# EAGLE design Binary-Watch_Rev_A (EAGLE 4.16)
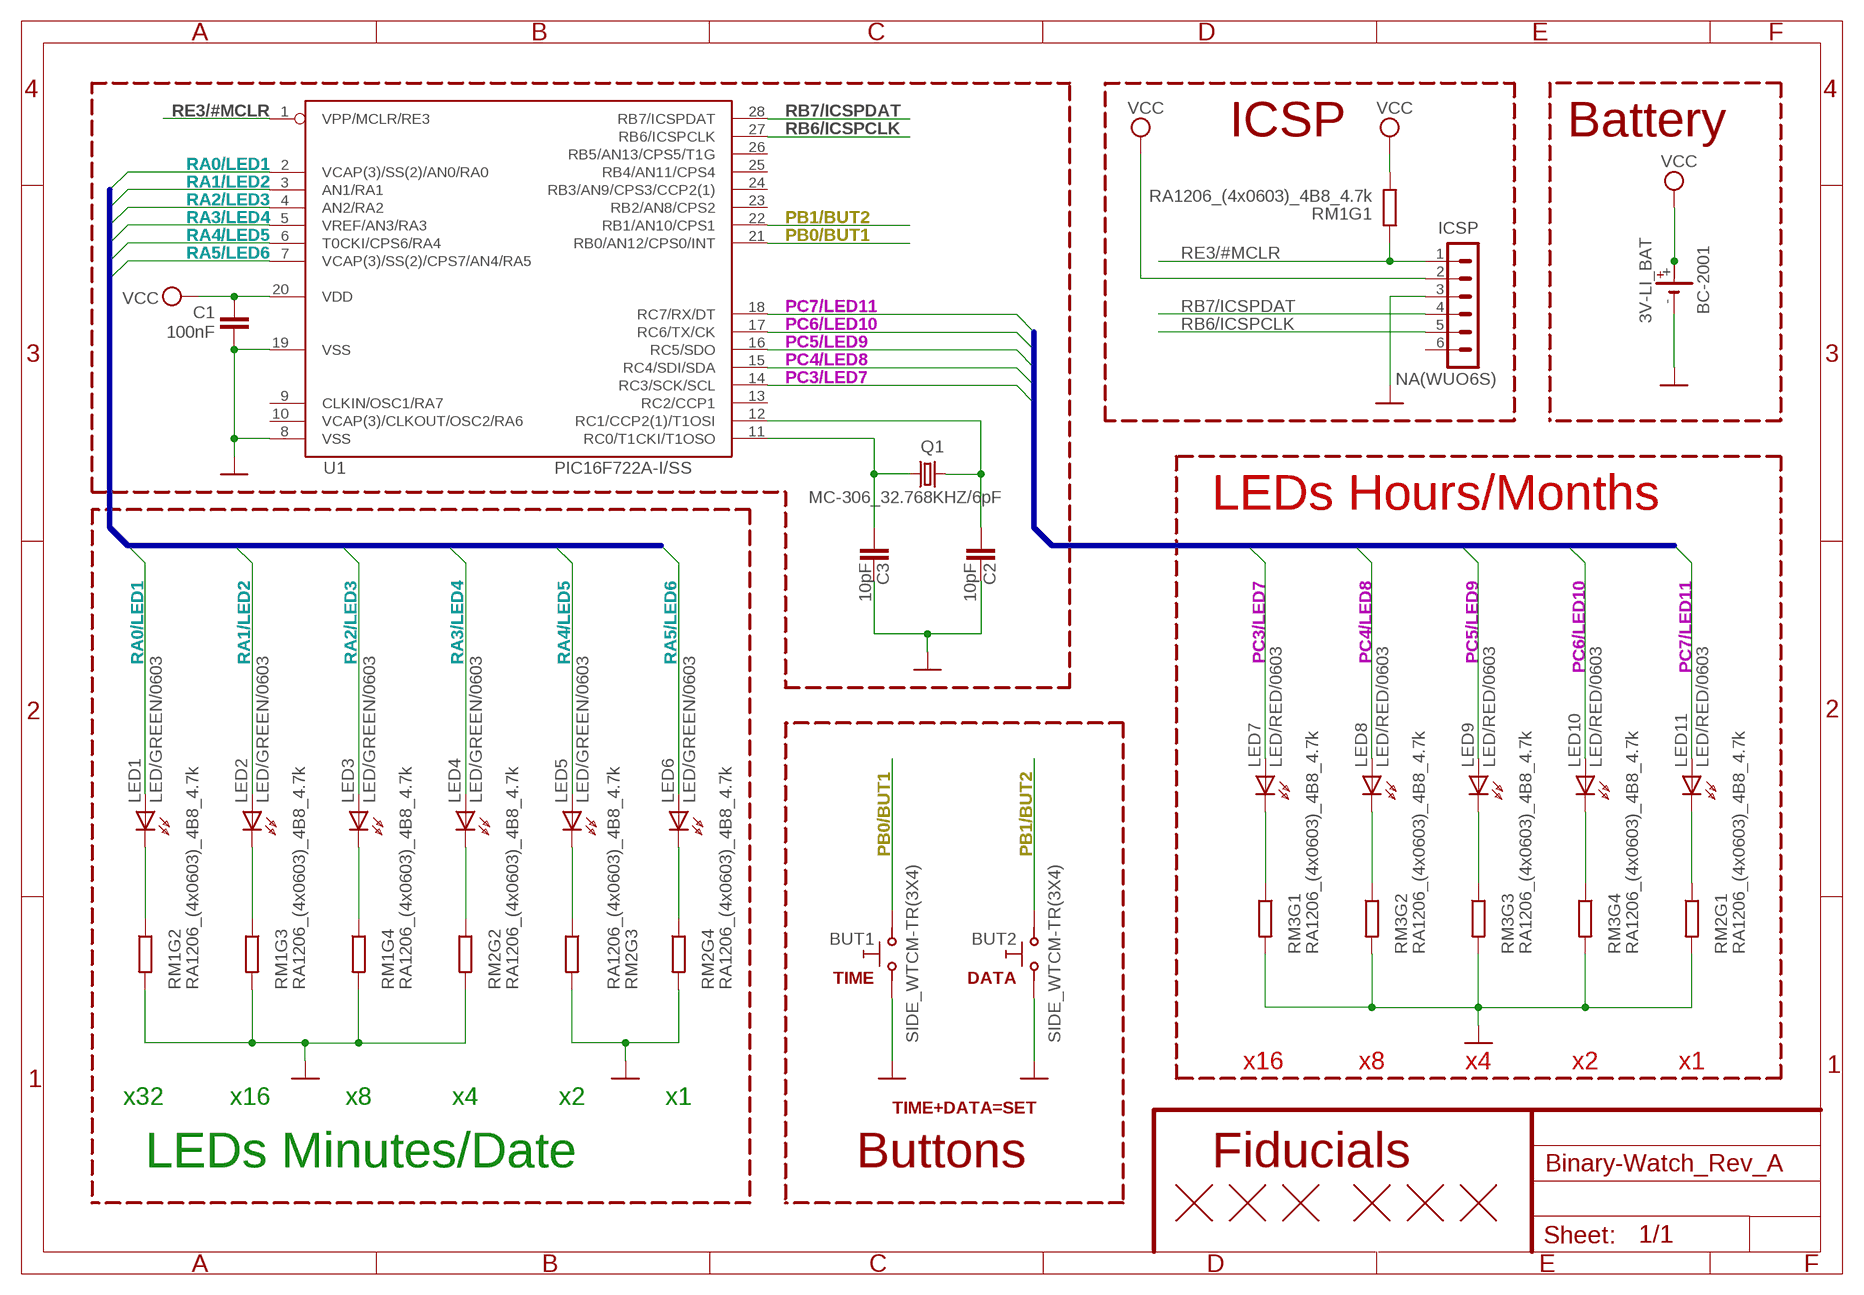
[diagram p0: schematic, sheet 1]

## Parts
3V-LI_BAT  BC-2001  BFLATWISE  [BAT-FLATWISE]
BUT1  SIDE_WTCM-TR(3X4)  SW-TAKTSIDE_WTCM-TR(3X4)  [SW_TAKT3X4]
BUT2  SIDE_WTCM-TR(3X4)  SW-TAKTSIDE_WTCM-TR(3X4)  [SW_TAKT3X4]
C1  100nF  C-EUC0603_DWS  [C0603_DWS]
C2  10pF  C-EUC0603_DWS  [C0603_DWS]
C3  10pF  C-EUC0603_DWS  [C0603_DWS]
FID1  FIDUCIAL  [FIDUCIAL-1X3]
FID2  FIDUCIAL  [FIDUCIAL-1X3]
FID3  FIDUCIAL  [FIDUCIAL-1X3]
FID4  FIDUCIAL  [FIDUCIAL-1X3]
FID5  FIDUCIAL  [FIDUCIAL-1X3]
FID6  FIDUCIAL  [FIDUCIAL-1X3]
ICSP  NA(WUO6S)  CON6WUO6S  [WU06S]
LED1  LED/GREEN/0603  LEDLED_0603_32_B  [LED_0603_32_B]
LED2  LED/GREEN/0603  LEDLED_0603_16_B  [LED_0603_16_B]
LED3  LED/GREEN/0603  LEDLED_0603_8_B  [LED_0603_8_B]
LED4  LED/GREEN/0603  LEDLED_0603_4_B  [LED_0603_4_B]
LED5  LED/GREEN/0603  LEDLED_0603_2_B  [LED_0603_2_B]
LED6  LED/GREEN/0603  LEDLED_0603_1_B  [LED_0603_1_B]
LED7  LED/RED/0603  LEDLED_0603_16_T  [LED_0603_16_T]
LED8  LED/RED/0603  LEDLED_0603_8_T  [LED_0603_8_T]
LED9  LED/RED/0603  LEDLED_0603_4_T  [LED_0603_4_T]
LED10  LED/RED/0603  LEDLED_0603_2_T  [LED_0603_2_T]
LED11  LED/RED/0603  LEDLED_0603_1_T  [LED_0603_1_T]
Q1  MC-306_32.768KHZ/6pF  MC-306_32.768KHZ/SMD_8038  [MC-306]
RM1  RA1206_(4x0603)_4B8_4.7k  R_MATRIX_4E  [R_MATRIX_4]
RM2  RA1206_(4x0603)_4B8_4.7k  R_MATRIX_4E  [R_MATRIX_4]
RM3  RA1206_(4x0603)_4B8_4.7k  R_MATRIX_4E  [R_MATRIX_4]
U1  PIC16F722A-I/SS  [SSOP28]

## Nets
GND: 3V-LI_BAT.- BUT1.2_1 BUT2.2_1 C1.2 C2.1 C3.1 ICSP.3 RM1.2.2 RM1.3.2 RM1.4.2 RM2.1.2 RM2.2.2 RM2.3.2 RM2.4.2 RM3.1.2 RM3.2.2 RM3.3.2 RM3.4.2 U1.8(VSS) U1.19(VSS)
N$1: LED1.C RM1.2.1
N$2: LED2.C RM1.3.1
N$3: LED3.C RM1.4.1
N$4: LED4.C RM2.2.1
N$5: LED5.C RM2.3.1
N$6: LED6.C RM2.4.1
N$8: C2.2 Q1.1 U1.12(RC1/CCP2(1)/T1OSI)
N$9: C3.2 Q1.4 U1.11(RC0/T1CKI/T1OSO)
N$10: LED7.C RM3.1.1
N$11: LED8.C RM3.2.1
N$12: LED9.C RM3.3.1
N$13: LED10.C RM3.4.1
N$15: LED11.C RM2.1.1
PB0/BUT1: BUT1.1_1 U1.21(RB0/AN12/CPS0/INT)
PB1/BUT2: BUT2.1_1 U1.22(RB1/AN10/CPS1)
PC3/LED7: LED7.A U1.14(RC3/SCK/SCL)
PC4/LED8: LED8.A U1.15(RC4/SDI/SDA)
PC5/LED9: LED9.A U1.16(RC5/SDO)
PC6/LED10: LED10.A U1.17(RC6/TX/CK)
PC7/LED11: LED11.A U1.18(RC7/RX/DT)
RA0/LED1: LED1.A U1.2(VCAP(3)/SS(2)/AN0/RA0)
RA1/LED2: LED2.A U1.3(AN1/RA1)
RA2/LED3: LED3.A U1.4(AN2/RA2)
RA3/LED4: LED4.A U1.5(VREF/AN3/RA3)
RA4/LED5: LED5.A U1.6(T0CKI/CPS6/RA4)
RA5/LED6: LED6.A U1.7(VCAP(3)/SS(2)/CPS7/AN4/RA5)
RB6/ICSPCLK: ICSP.5 U1.27(RB6/ICSPCLK)
RB7/ICSPDAT: ICSP.4 U1.28(RB7/ICSPDAT)
RE3/#MCLR: ICSP.1 RM1.1.2 U1.1(VPP/MCLR/RE3)
VCC: 3V-LI_BAT.+ 3V-LI_BAT.+@1(+) C1.1 ICSP.2 RM1.1.1 U1.20(VDD)
Unconnected: ICSP.6 U1.9(CLKIN/OSC1/RA7) U1.10(VCAP(3)/CLKOUT/OSC2/RA6) U1.13(RC2/CCP1) U1.23(RB2/AN8/CPS2) U1.24(RB3/AN9/CPS3/CCP2(1)) U1.25(RB4/AN11/CPS4) U1.26(RB5/AN13/CPS5/T1G)

## Buses
RA0/LED1,RA1/LED2,RA2/LED3,RA3/LED4,RA4/LED5,RA5/LED6
PC3/LED7,PC4/LED8,PC5/LED9,PC6/LED10,PC7/LED11

## Notes on the sheet
- ICSP | Battery
- LEDs Hours/Months
- TIME | DATA
- x16 | x8 | x4 | x2 | x1
- x32 | x16 | x8 | x4 | x2 | x1
- TIME+DATA=SET
- LEDs Minutes/Date | Buttons | Fiducials

## Library data of the parts
3V-LI_BAT = DOUBLE-SIDE:B: LI BATTERY Varta
BUT1 BUT2 = gogo:SW-TAKT
C1-C3 = rcl:C-EU: CAPACITOR, European symbol
FID1-FID6 = SparkFunEagle-6-6-07:FIDUCIAL: Fiducial Alignment Points Various fiducial points for machine vision alignment.
ICSP = Penko:CON6: CONNECTORS - 6 PINS
LED1-LED11 = DOUBLE-SIDE:LED
Q1 = crystal:MC-306
RM1-RM3 = OLIMEX_DISCRET:R_MATRIX_4E
U1 = OLIMEX_IC:PIC16F722A: PIC16F722A Description: 28-Pin Flash Microcontrollers with nanoWatt XLP Technology

## Net classes
1 pwr: width 1.016 mm, drill 0.241 mm

## Board
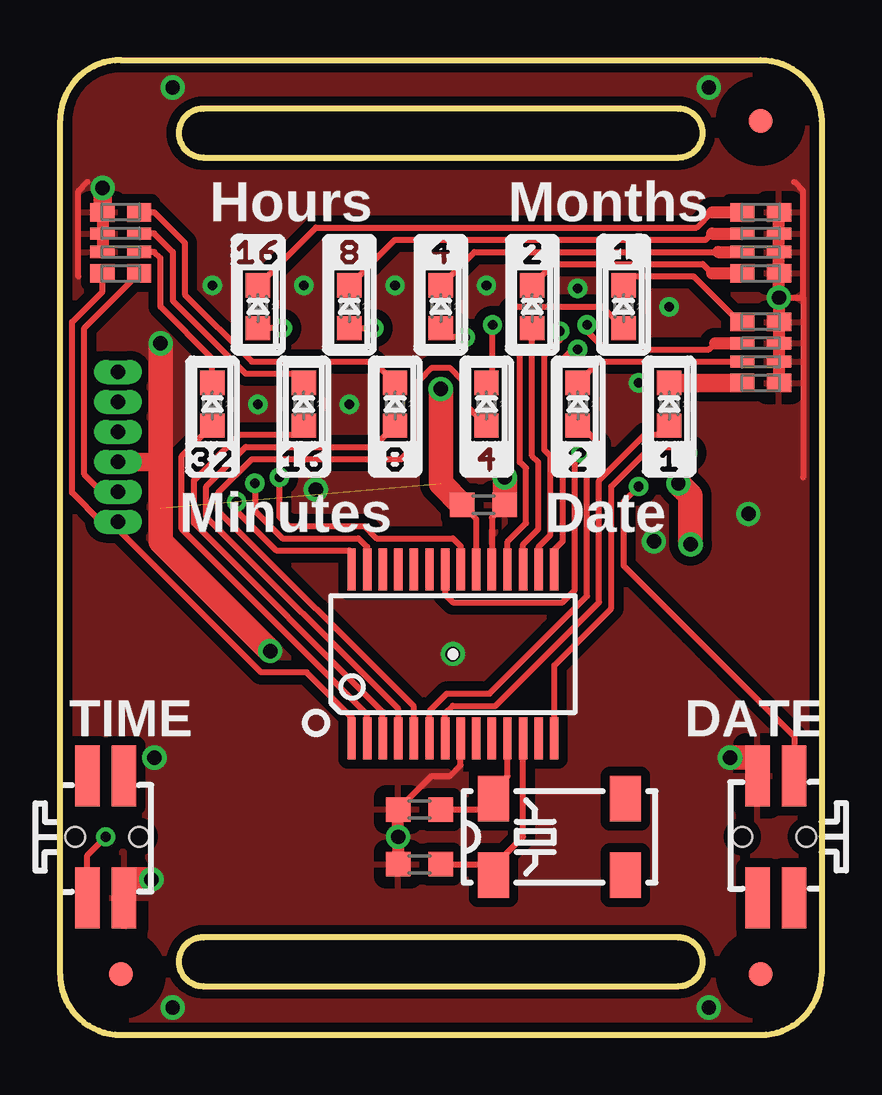
[diagram p1: board, top side]
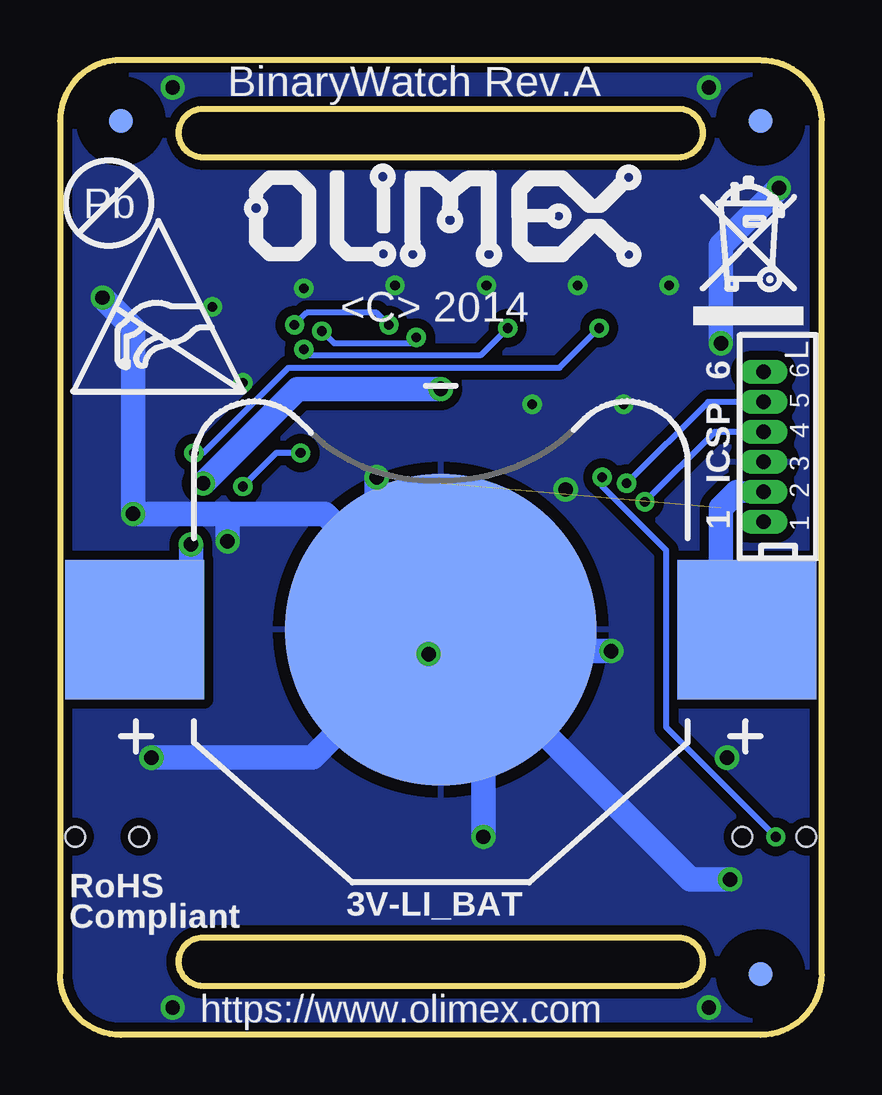
[diagram p2: board, bottom side, seen from below]

Size 31.75 x 40.64 mm. Coordinates in mm from the lower left corner, seen from the top.
Outline: 0,2.54 0,38.1 arc-90 2.54,40.64 29.21,40.64 arc-90 31.75,38.1 31.75,2.54 arc-90 29.21,0 2.54,0 arc-90 0,2.54
Outline: 5.97,36.58 25.78,36.58 arc180 25.78,38.61 5.97,38.61 arc180 5.97,36.58
Outline: 5.97,2.03 25.78,2.03 arc180 25.78,4.06 5.97,4.06 arc180 5.97,2.03
Copper layers (1*16): Top 0.035mm / dielectric 1.5mm / Bottom 0.035mm
Design rules "default": minimum track width 10mil, minimum drill 15mil, track to track 8mil, track to pad 8mil, pad to pad 8mil, via to via 8mil, smd to smd 1mil, copper to edge 10mil, drill to drill 8mil, minimum pad ring 7mil, minimum via ring 8mil, stop-mask expansion 4mil, vias tented up to drill 40mil, thermal gap 20mil

### Footprints (pad centres in the part's own frame; a part is rotated, then mirrored left to right if it is on the bottom)
BAT-FLATWISE = smd 5.8 x 5.8: + 12.764,0; +@1 -12.764,0 | smd 13 x 13: - 0,0
SW_TAKT3X4 = smd 2.54 x 1.016: 1_1 -2.54,0.762; 1_2 2.54,0.762; 2_1 -2.54,-0.762; 2_2 2.54,-0.762 | hole 0.8: 0,-1.397; 0,1.27
C0603_DWS = smd 1.016 x 1.016: 1 -0.889,0; 2 0.889,0
FIDUCIAL-1X3 = smd 1 x 1: 1 0,0
WU06S = drill 0.6 pad 0.991 long: 1 -3.125,0; 2 -1.875,0; 3 -0.625,0; 4 0.625,0; 5 1.875,0; 6 3.125,0
LED_0603_32_B = smd 1.016 x 1.016: A 0.889,0; C -0.889,0
LED_0603_16_B = smd 1.016 x 1.016: A 0.889,0; C -0.889,0
LED_0603_8_B = smd 1.016 x 1.016: A 0.889,0; C -0.889,0
LED_0603_4_B = smd 1.016 x 1.016: A 0.889,0; C -0.889,0
LED_0603_2_B = smd 1.016 x 1.016: A 0.889,0; C -0.889,0
LED_0603_1_B = smd 1.016 x 1.016: A 0.889,0; C -0.889,0
LED_0603_16_T = smd 1.016 x 1.016: A 0.889,0; C -0.889,0
LED_0603_8_T = smd 1.016 x 1.016: A 0.889,0; C -0.889,0
LED_0603_4_T = smd 1.016 x 1.016: A 0.889,0; C -0.889,0
LED_0603_2_T = smd 1.016 x 1.016: A 0.889,0; C -0.889,0
LED_0603_1_T = smd 1.016 x 1.016: A 0.889,0; C -0.889,0
MC-306 = smd 1.3 x 1.9: 1 -2.75,-1.6; 2 2.75,-1.6; 3 2.75,1.6; 4 -2.75,1.6
R_MATRIX_4 = smd 0.762 x 1.016: 1.1 -1.27,-0.762; 1.2 -1.27,0.762; 4.1 1.27,-0.762; 4.2 1.27,0.762 | smd 0.508 x 1.016: 2.1 -0.381,-0.762; 2.2 -0.381,0.762; 3.1 0.381,-0.762; 3.2 0.381,0.762
SSOP28 = smd 0.35 x 1.75: 1 -4.225,-3.525; 2 -3.575,-3.525; 3 -2.925,-3.525; 4 -2.275,-3.525; 5 -1.625,-3.525; 6 -0.975,-3.525; 7 -0.325,-3.525; 8 0.325,-3.525; 9 0.975,-3.525; 10 1.625,-3.525; 11 2.275,-3.525; 12 2.925,-3.525; 13 3.575,-3.525; 14 4.225,-3.525; 15 4.225,3.525; 16 3.575,3.525; 17 2.925,3.525; 18 2.275,3.525; 19 1.625,3.525; 20 0.975,3.525; 21 0.325,3.525; 22 -0.325,3.525; 23 -0.975,3.525; 24 -1.625,3.525; 25 -2.275,3.525; 26 -2.925,3.525; 27 -3.575,3.525; 28 -4.225,3.525

### Placement (x,y rotation side)
3V-LI_BAT  15.88,16.89 180 bottom
BUT1  1.91,8.26 90 top
BUT2  29.84,8.26 270 top
C1  17.65,22.1 0 top
C2  14.99,7.11 0 top
C3  14.99,9.4 0 top
FID1  2.54,2.54 0 top
FID2  29.21,2.54 0 top
FID3  29.21,38.1 0 top
FID4  2.54,2.54 0 bottom
FID5  2.54,38.1 0 bottom
FID6  29.21,38.1 0 bottom
ICSP  2.41,24.51 90 bottom
LED1  6.35,26.29 270 top
LED2  10.16,26.29 270 top
LED3  13.97,26.29 270 top
LED4  17.78,26.29 270 top
LED5  21.59,26.29 270 top
LED6  25.4,26.29 270 top
LED7  8.26,30.35 270 top
LED8  12.06,30.35 270 top
LED9  15.88,30.35 270 top
LED10  19.68,30.35 270 top
LED11  23.5,30.35 270 top
Q1  20.83,8.26 0 top
RM1  2.54,33.02 90 top
RM2  29.21,28.45 270 top
RM3  29.21,33.02 270 top
U1  16.38,15.88 0 top
U$1  [ESD_SYMBOL]  31.2,26.82 0 bottom
U$5  [PB_SMALL]  29.72,34.67 0 bottom
U$6  [RECYCLE_BIN1/8]  5.33,29.59 0 bottom
U$7  [OLIMEX1_V]  6.35,31.88 0 bottom

### Tracks (layer width: path | path; a pad name or v marks a point on that pad's centre or on a via)
GND  (via drill 0.4, 0.6)
  Top 0.254: 0.76,31.62 0.76,35.18 1.14,35.56 | v29.97,30.73 30.99,30.73 | 30.99,30.73 30.99,35.18 30.61,35.56 | 30.99,30.73 30.99,23.24 | U1.19 18.01,21.56 C1.2 | U1.8 16.71,11.25 16.26,10.79 15.49,10.79 C3.1
  Top 0.508: RM1.4.2 RM1.3.2 RM1.2.2 | RM3.1.2 RM3.2.2 RM3.3.2 RM3.4.2 v29.97,30.73 RM2.1.2 RM2.2.2 RM2.3.2 RM2.4.2 | C3.1 v14.1,8.26 C2.1
  Top 0.762: 4.19,23.89 ICSP.3 | v1.78,35.31 RM1.4.2
  Top 1.016: v8.76,16 4.19,20.57 4.19,23.89 v4.19,28.83 | v18.54,23.24 C1.2 | v27.94,11.56 29.08,11.56 BUT2.2_1 | BUT1.2_1 2.67,6.48 v3.81,6.48
  Bottom 1.016: 14.1,15.11 v14.1,8.26 | 14.99,16 v8.76,16 | v29.97,30.73 28.7,29.46 v28.7,21.72 24.77,21.72 | 18.54,19.56 20.7,21.72 24.77,21.72 | 24.77,21.72 v24.77,20.57 | 14.1,15.11 5.46,6.48 v3.81,6.48 | 14.1,15.11 14.99,16 | 14.99,16 3V-LI_BAT.- | 3V-LI_BAT.- 18.54,19.56 | 18.54,19.56 v18.54,23.24 | 3V-LI_BAT.- 21.21,11.56 v27.94,11.56 | v4.19,28.83 4.19,32.89 v1.78,35.31
  other vias: 3.94,11.56 4.7,39.5 27.05,1.14 4.7,1.14 27.05,39.5 16.38,15.88 10.67,22.73 8.26,26.29 12.06,26.29 10.16,31.24 13.97,31.24 17.78,31.24 6.35,31.24 24.13,27.18 21.59,31.11 25.4,30.35
  pour Bottom (isolate 0.381, rank 2): 36.83,45.72 -5.08,45.72 -5.08,-5.08 36.83,-5.08
  pour Top (isolate 0.381, rank 2): -2.54,43.18 34.29,43.18 34.29,-2.54 -2.54,-2.54
N$1
  Top 0.254: RM1.2.1 3.94,32.64 4.19,32.38 4.19,30.35 6.35,28.19 LED1.C
N$2
  Top 0.254: LED2.C 9.78,27.56 7.75,27.56 4.7,30.61 4.7,32.64 3.94,33.4 RM1.3.1
N$3
  Top 0.254: LED3.C 13.08,28.07 8,28.07 5.21,30.86 5.21,33.02 3.94,34.29 RM1.4.1
N$4  (via drill 0.4)
  Top 0.254: LED4.C 18.03,27.43 v18.03,29.59 | 27.3,28.83 27.05,28.57 22.73,28.57 21.97,29.34 v21.97,29.59
  Top 0.508: 27.3,28.83 RM2.2.1
  Bottom 0.254: v18.03,29.59 18.54,30.1 21.46,30.1 v21.97,29.59
N$5
  Top 0.254: LED5.C 22.48,28.07 RM2.3.1
N$6
  Top 0.762: LED6.C RM2.4.1
N$8
  Top 0.254: 18.08,7.03 Q1.1 | U1.12 19.31,8.26 18.08,7.03 | 18.08,7.03 18,7.11 C2.2
N$9
  Top 0.254: U1.11 18.66,10.78 18.08,10.2 Q1.4 17.62,9.4 C3.2
N$10
  Top 0.254: LED7.C 10.67,33.66 26.54,33.66 27.18,34.29
  Top 0.508: 27.18,34.29 RM3.1.1
N$11
  Top 0.254: LED8.C 13.97,33.15 26.92,33.15 27.18,33.4
  Top 0.508: 27.18,33.4 RM3.2.1
N$12
  Top 0.254: LED9.C 17.27,32.64 27.43,32.64
  Top 0.508: 27.43,32.64 RM3.3.1
N$13
  Top 0.254: LED10.C 20.57,32.13 26.8,32.13 27.18,31.75
  Top 0.508: 27.18,31.75 RM3.4.1
N$15
  Top 0.254: LED11.C 23.88,31.62 26.42,31.62 28.32,29.72 RM2.1.1
PB0/BUT1  (via drill 0.4)
  Top 0.254: U1.21 16.71,20.38 16.38,20.7 13.21,20.7 12.7,21.21 9.53,21.21 9.14,21.59 v9.14,23.24 | v1.91,8.26 1.14,7.49 BUT1.1_1
  Bottom 0.254: v9.14,23.24 9.14,22.86 6.48,20.19 6.48,12.83 v1.91,8.26
PB1/BUT2  (via drill 0.4)
  Top 0.254: U1.22 16.06,18.36 16.38,18.03 20.95,18.03 21.46,18.54 21.46,24 v21.72,24.26 | v24.13,22.86 23.5,22.23 23.5,19.56 30.61,12.45 BUT2.1_1
  Bottom 0.254: v21.72,24.26 22.73,24.26 v24.13,22.86
PC3/LED7  (via drill 0.4)
  Top 0.254: U1.14 20.61,15.4 22.99,17.78 22.99,22.86 24.64,24.51 25.91,24.51 v26.16,24.26 | v9.27,29.46 LED7.A
  Bottom 0.254: v26.16,24.26 25.78,24.26 22.23,27.81 10.92,27.81 v9.27,29.46
PC4/LED8  (via drill 0.4)
  Top 0.254: U1.15 20.61,20.23 20.95,20.57 20.95,24.38 20.7,24.64 20.7,27.94 21.34,28.57 v21.59,28.57 | LED8.A v13.08,29.46
  Bottom 0.254: v13.08,29.46 14.22,28.32 21.34,28.32 v21.59,28.57
PC5/LED9  (via drill 0.4)
  Top 0.254: U1.16 19.96,20.34 20.45,20.83 20.45,24.13 20.19,24.38 20.19,28.32 20.83,28.96 v20.83,29.34 | v16.89,29.08 16.26,29.08 LED9.A
  Bottom 0.254: v20.83,29.34 20.32,28.83 17.14,28.83 v16.89,29.08
PC6/LED10
  Top 0.254: U1.17 19.31,20.45 19.94,21.08 19.94,23.88 19.68,24.13 LED10.A
PC7/LED11
  Top 0.254: U1.18 18.66,20.56 19.43,21.34 19.43,23.62 19.18,23.88 19.18,28.32 18.8,28.7 18.8,30.23 18.92,30.35 22.61,30.35 LED11.A
RA0/LED1
  Top 0.254: U1.2 12.81,13.35 5.08,21.08 5.08,24.13 LED1.A
RA1/LED2
  Top 0.254: U1.3 13.46,13.47 5.59,21.34 5.59,23.11 7.49,25.02 9.78,25.02 LED2.A
RA2/LED3
  Top 0.254: U1.4 14.11,13.58 6.1,21.59 6.1,22.86 7.75,24.51 13.08,24.51 LED3.A
RA3/LED4
  Top 0.254: U1.5 14.76,13.69 6.6,21.84 6.6,22.61 8,24 14.22,24 14.99,24.77 14.99,27.3 15.49,27.81 16.26,27.81 16.76,27.3 16.76,26.42 LED4.A
RA4/LED5
  Top 0.254: U1.6 15.41,13.5 16.13,14.22 17.91,14.22 21.97,18.29 21.97,23.37 22.48,23.88 22.48,24.64 21.72,25.4 LED5.A
RA5/LED6
  Top 0.254: U1.7 16.06,13.39 16.38,13.72 18.16,13.72 22.48,18.03 22.48,23.11 24.38,25.02 25.02,25.02 LED6.A
RB6/ICSPCLK  (via drill 0.4)
  Top 0.254: U1.27 12.81,20.34 12.45,20.7 9.27,20.7 8.13,21.84 v8.13,22.99
  Bottom 0.254: ICSP.5 4.73,26.39 v8.13,22.99
RB7/ICSPDAT  (via drill 0.4)
  Top 0.254: U1.28 12.16,20.1 12.06,20.19 9.02,20.19 7.37,21.84 v7.37,22.23
  Bottom 0.254: ICSP.4 4.46,25.14 v7.37,22.23
RE3/#MCLR
  Top 0.254: U1.1 12.16,13.24 10.29,15.11 8.38,15.11 2.41,21.08 ICSP.1 1.73,21.39 0.51,22.61 0.51,29.72 1.78,30.99 RM1.1.2
VCC  (via drill 0.6)  (1 unrouted)
  Top 0.254: U1.20 17.36,21.5 C1.1 | ICSP.2 1.75,22.64 1.02,23.37 1.02,29.46 RM1.1.1
  Top 1.016: C1.1 15.88,22.99 v15.88,26.92 | v26.29,20.45 26.29,22.48 v25.78,22.99
  Bottom 0.889: 3.53,22.64 ICSP.2
  Bottom 1.016: 3V-LI_BAT.+@1 4.19,17.97 4.19,21.97 3.53,22.64 | v26.29,20.45 26.29,19.24 3V-LI_BAT.+ | v25.78,22.99 21.84,26.92 v15.88,26.92

### Text on the board
Top: BLACK - Solder Mask | WHITE- Comp. Print
tNames: Hours | Months | Minutes | Date | TIME | DATE
bNames: BinaryWatch Rev.A | <C> 2014 | 6 | 1 | RoHS | Compliant | https://www.olimex.com
tTest: 8 | 4 | 2 | 1 | 32 | 16 | 8 | 4 | 2 | 1